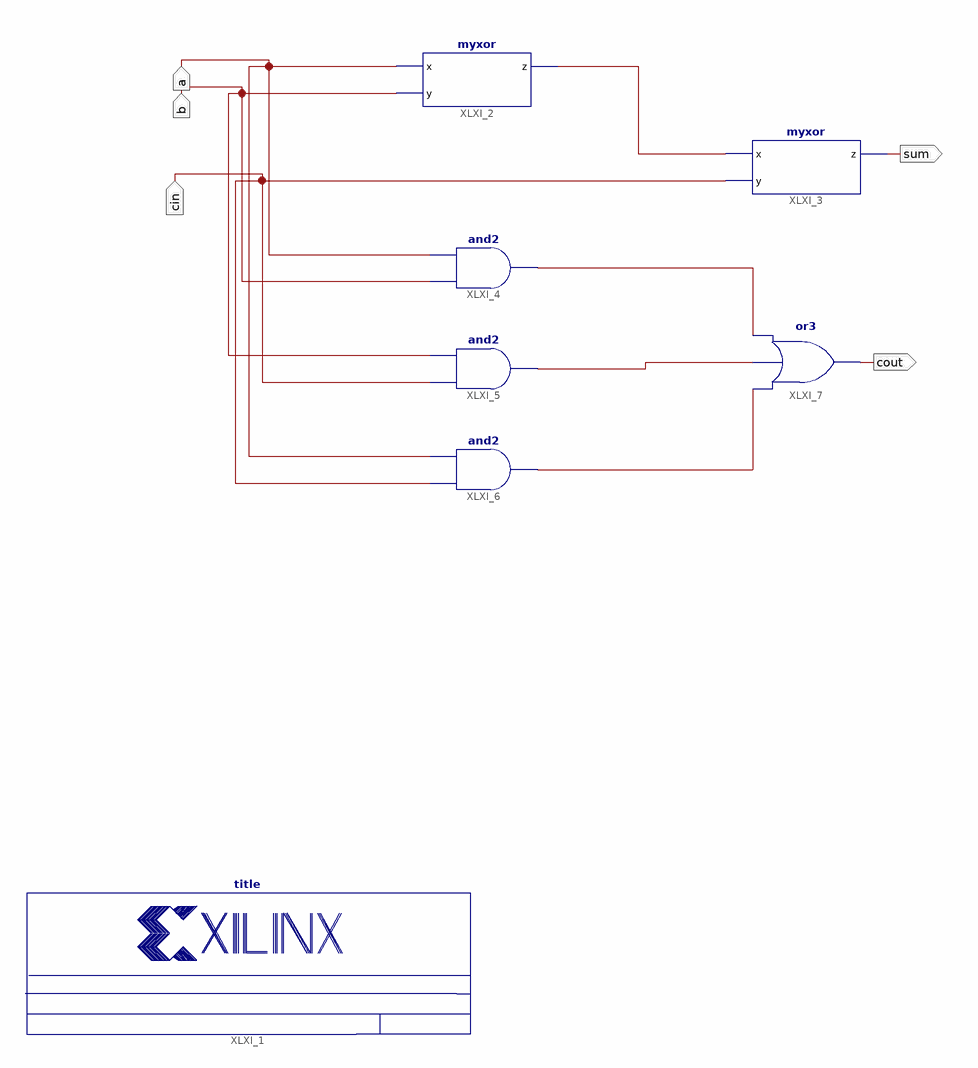
[diagram p0: schematic sheet 1]
// Xilinx ISE schematic full_adder_sch.sch (spartan3e) as structural Verilog: 7 symbols, 5 ports
module full_adder_sch (
  input  a,
  input  b,
  input  cin,
  output sum,
  output cout
);

  wire XLXN_9, XLXN_21, XLXN_22, XLXN_23;

  title #(.NameFieldText("Full adder")) XLXI_1 ();
  myxor XLXI_2 (.x(a), .y(b), .z(XLXN_9));
  myxor XLXI_3 (.x(XLXN_9), .y(cin), .z(sum));
  and XLXI_4 (XLXN_21, b, a);
  and XLXI_5 (XLXN_22, cin, b);
  and XLXI_6 (XLXN_23, cin, a);
  or XLXI_7 (cout, XLXN_23, XLXN_22, XLXN_21);
endmodule
